# Altium schematic sheet MINIOLED.SchDoc
size A3
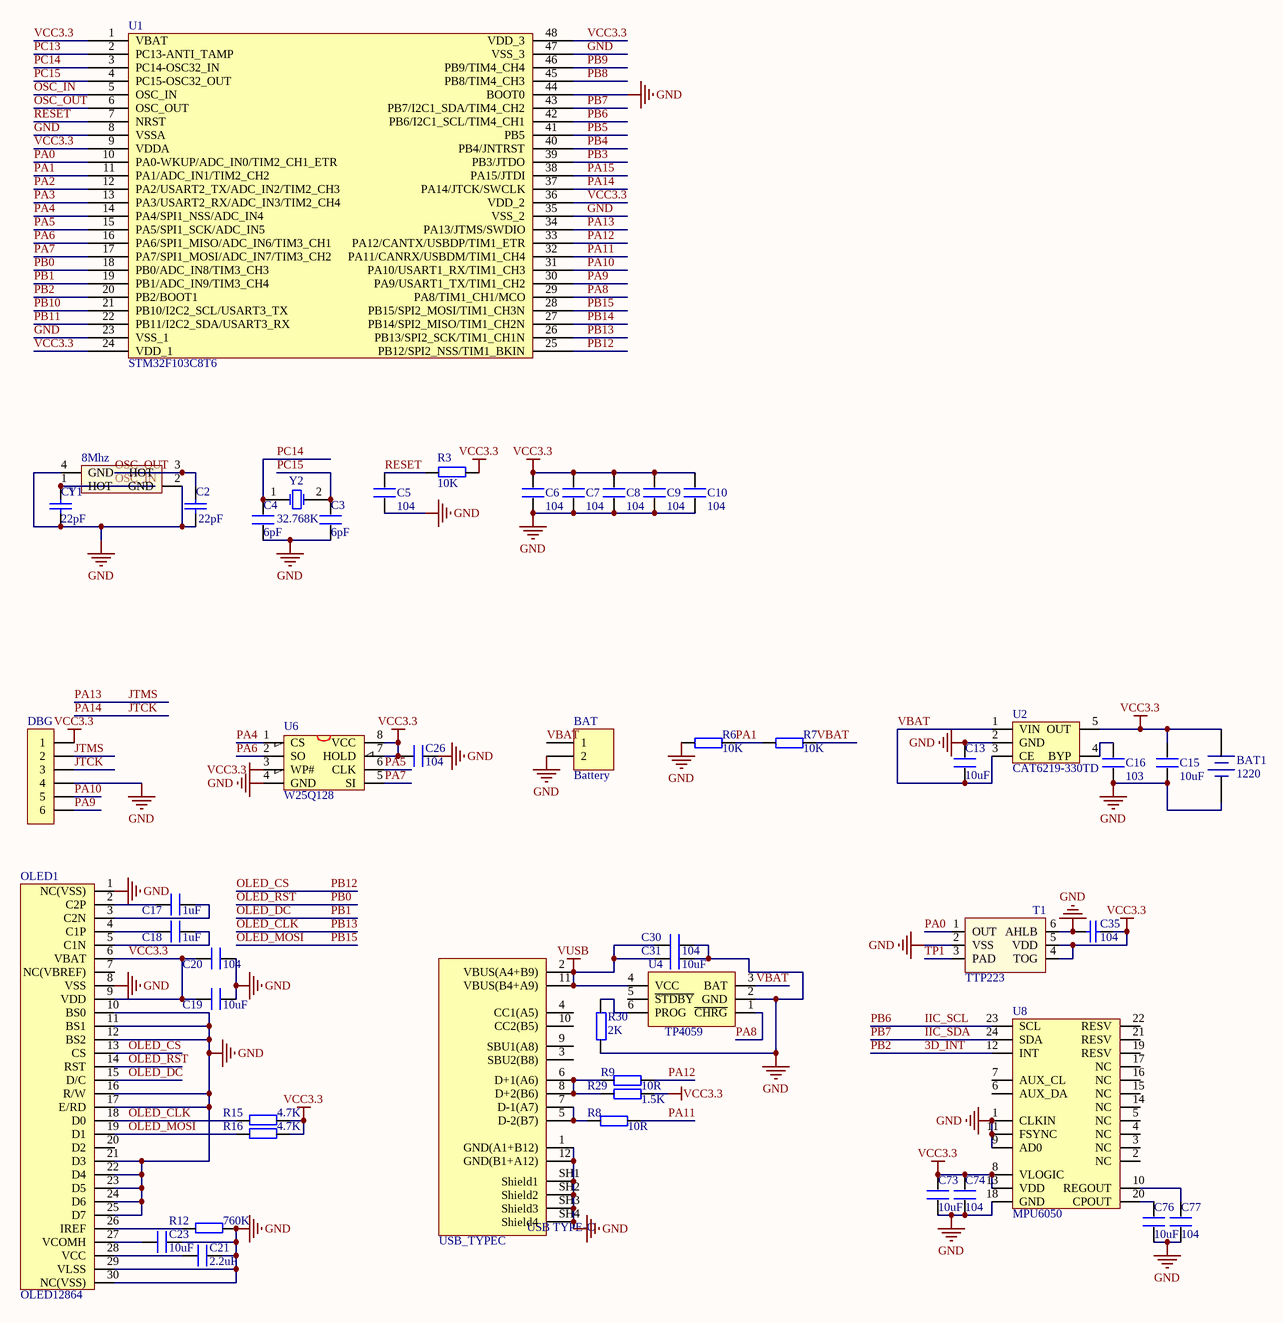
[diagram p0: MINIOLED.SchDoc]

## Parts
BAT  Battery  [HDR1X2]
BAT1  1220  [CR1220_B]
C1  22pF  [C 0402_L]
C2  22pF  [C 0402_L]
C3  6pF  [C 0402_L]
C4  6pF  [C 0402_L]
C5  104  [C 0402_L]
C6  104  [C 0402_L]
C7  104  [C 0402_L]
C8  104  [C 0402_L]
C9  104  [C 0402_L]
C10  104  [C 0402_L]
C13  10uF  [C 0402_L]
C15  10uF  [C 0402_L]
C16  103  [C 0402_L]
C17  1uF  [C 0402_L]
C18  1uF  [C 0402_L]
C19  10uF  [C 0402_L]
C20  104  [C 0402_L]
C21  2.2uF  [C 0402_L]
C23  10uF  [C 0402_L]
C26  104  [C 0603_L]
C30  104  [C 0402_L]
C31  10uF  [C 0402_L]
C35  104  [C 0402_L]
C73  10uF  [C 0402_L]
C74  104  [C 0402_L]
C76  10uF  [C 0402_L]
C77  104  [C 0402_L]
DBG  GPS&COMPASS  [SH1.0 S-W-6P]  (value not drawn)
OLED1  OLED12864  [OLED1.3]
R3  10K  [R 0402_L]
R6  10K  [R 0402_L]
R7  10K  [R 0402_L]
R8  10R  [R 0402_L]
R9  10R  [R 0402_L]
R12  760K  [R 0402_L]
R15  4.7K  [R 0402_L]
R16  4.7K  [R 0402_L]
R29  1.5K  [R 0402_L]
R30  2K  [R 0402_L]
T1  TTP223  [SOT23-6L]
U1  STM32F103C8T6  [LQFP48 7X7_L]
U2  CAT6219-330TD  [SOT-23-5]
U4  TP4059  [SOT23-6L]
U6  W25Q128  [SOP8W_L]
U8  MPU6050  [QFN24 4x4_N]
USB_TYPEC  USB TypeC  [USB Type-C]  (value not drawn)
Y1  8Mhz  [XTAL-3225]
Y2  32.768K  [OSC 3215-2P]

## Nets
GND: BAT.2 BAT1.2(DC-) C1.1 C2.1 C3.1 C4.1 C5.1 C6.1 C7.1 C8.1 C9.1 C10.1 C13.2 C15.1 C16.1 C19.1 C20.1 C21.1 C23.1 C26.2 C30.1 C31.1 C35.2 C73.2 C74.1 C76.1 C77.2 DBG.4 OLED1.1(NC(VSS)) OLED1.8(VSS) OLED1.10(BS0) OLED1.11(BS1) OLED1.12(BS2) OLED1.16(R/W) OLED1.17(E/RD) OLED1.21(D3) OLED1.22(D4) OLED1.23(D5) OLED1.24(D6) OLED1.25(D7) OLED1.29(VLSS) OLED1.30(NC(VSS)) R6.1 R12.1 R30.1 T1.2(VSS) T1.6(AHLB) U1.8(VSSA) U1.23(VSS_1) U1.35(VSS_2) U1.44(BOOT0) U1.47(VSS_3) U2.2(GND) U4.2(GND) U6.4(GND) U8.1(CLKIN) U8.9(AD0) U8.11(FSYNC) U8.18(GND) USB_TYPEC.1(GND(A1+B12)) USB_TYPEC.12(GND(B1+A12)) USB_TYPEC.SH1(Shield1) USB_TYPEC.SH2(Shield2) USB_TYPEC.SH3(Shield3) USB_TYPEC.SH4(Shield4) Y1.2(GND) Y1.4(GND)
VCC3.3: BAT1.1(DC+) C6.2 C7.2 C8.2 C9.2 C10.2 C15.2 C19.2 C20.2 C26.1 C35.1 C73.1 C74.2 DBG.1 OLED1.6(VBAT) OLED1.9(VDD) R3.1 R15.1 R16.1 R29.2 T1.4(TOG) T1.5(VDD) U1.1(VBAT) U1.9(VDDA) U1.24(VDD_1) U1.36(VDD_2) U1.48(VDD_3) U2.5(OUT) U6.3(WP#) U6.7(HOLD) U6.8(VCC) U8.8(VLOGIC) U8.13(VDD)
VUSB: C30.2 C31.2 U4.4(VCC) USB_TYPEC.2(VBUS(A4+B9)) USB_TYPEC.11(VBUS(B4+A9))
3D_INT: U1.20(PB2/BOOT1) U8.12(INT)  [also labelled PB2]
IIC_SCL: U1.42(PB6/I2C1_SCL/TIM4_CH1) U8.23(SCL)  [also labelled PB6]
IIC_SDA: U1.43(PB7/I2C1_SDA/TIM4_CH2) U8.24(SDA)  [also labelled PB7]
JTCK: DBG.3 U1.37(PA14/JTCK/SWCLK)  [also labelled PA14]
JTMS: DBG.2 U1.34(PA13/JTMS/SWDIO)  [also labelled PA13]
OLED_CLK: OLED1.18(D0) R15.2 U1.26(PB13/SPI2_SCK/TIM1_CH1N)  [also labelled PB13]
OLED_CS: OLED1.13(CS) U1.25(PB12/SPI2_NSS/TIM1_BKIN)  [also labelled PB12]
OLED_DC: OLED1.15(D/C) U1.19(PB1/ADC_IN9/TIM3_CH4)  [also labelled PB1]
OLED_MOSI: OLED1.19(D1) R16.2 U1.28(PB15/SPI2_MOSI/TIM1_CH3N)  [also labelled PB15]
OLED_RST: OLED1.14(RST) U1.18(PB0/ADC_IN8/TIM3_CH3)  [also labelled PB0]
OSC_IN: C1.2 U1.5(OSC_IN) Y1.1(HOT)
OSC_OUT: C2.2 U1.6(OSC_OUT) Y1.3(HOT)
PA0: T1.1(OUT) U1.10(PA0-WKUP/ADC_IN0/TIM2_CH1_ETR)
PA1: R6.2 R7.1 U1.11(PA1/ADC_IN1/TIM2_CH2)
PA2: U1.12(PA2/USART2_TX/ADC_IN2/TIM2_CH3)
PA3: U1.13(PA3/USART2_RX/ADC_IN3/TIM2_CH4)
PA4: U1.14(PA4/SPI1_NSS/ADC_IN4) U6.1(CS)
PA5: U1.15(PA5/SPI1_SCK/ADC_IN5) U6.6(CLK)
PA6: U1.16(PA6/SPI1_MISO/ADC_IN6/TIM3_CH1) U6.2(SO)
PA7: U1.17(PA7/SPI1_MOSI/ADC_IN7/TIM3_CH2) U6.5(SI)
PA8: U1.29(PA8/TIM1_CH1/MCO) U4.1(~{CHRG})
PA9: DBG.6 U1.30(PA9/USART1_TX/TIM1_CH2)
PA10: DBG.5 U1.31(PA10/USART1_RX/TIM1_CH3)
PA11: R8.2 U1.32(PA11/CANRX/USBDM/TIM1_CH4)
PA12: R9.2 U1.33(PA12/CANTX/USBDP/TIM1_ETR)
PA15: U1.38(PA15/JTDI)
PB3: U1.39(PB3/JTDO)
PB4: U1.40(PB4/JNTRST)
PB5: U1.41(PB5)
PB8: U1.45(PB8/TIM4_CH3)
PB9: U1.46(PB9/TIM4_CH4)
PB10: U1.21(PB10/I2C2_SCL/USART3_TX)
PB11: U1.22(PB11/I2C2_SDA/USART3_RX)
PB14: U1.27(PB14/SPI2_MISO/TIM1_CH2N)
PC13: U1.2(PC13-ANTI_TAMP)
PC14: C4.2 U1.3(PC14-OSC32_IN) Y2.1(OSC1)
PC15: C3.2 U1.4(PC15-OSC32_OUT) Y2.2(OSC2)
RESET: C5.2 R3.2 U1.7(NRST)
TP1: T1.3(PAD)
VBAT: BAT.1 C13.1 R7.2 U2.1(VIN) U2.3(CE) U4.3(BAT)
NetC16_2: C16.2 U2.4(BYP)
NetC17_1: C17.1 OLED1.3(C2N)
NetC17_2: C17.2 OLED1.2(C2P)
NetC18_1: C18.1 OLED1.5(C1N)
NetC18_2: C18.2 OLED1.4(C1P)
NetC21_2: C21.2 OLED1.28(VCC)
NetC23_2: C23.2 OLED1.27(VCOMH)
NetC76_2: C76.2 U8.20(CPOUT)
NetC77_1: C77.1 U8.10(REGOUT)
NetOLED1_26: OLED1.26(IREF) R12.2
NetR8_1: R8.1 USB_TYPEC.5(D-2(B7)) USB_TYPEC.7(D-1(A7))
NetR9_1: R9.1 R29.1 USB_TYPEC.6(D+1(A6)) USB_TYPEC.8(D+2(B6))
NetR30_2: R30.2 U4.6(PROG)

Not connected (* = marked no-connect by the designer): OLED1 7(NC(VBREF)) 20(D2); U4 5(~{STDBY}); U8 2(NC) 3(NC) 4(NC) 5(NC) 6(AUX_DA) 7(AUX_CL) 14(NC) 15(NC) 16(NC) 17(NC) 19(RESV) 21(RESV) 22(RESV); USB_TYPEC 3(SBU2(B8)) 4(CC1(A5)) 9(SBU1(A8)) 10(CC2(B5))

## Notes on the sheet
- (in symbol USB Type-C) USB TYPE-C

## Library data of the parts
BAT = Header 2: Header, 2-Pin; LatestRevisionDate: 17-Jul-2002; LatestRevisionNote: Re-released for DXP Platform.; Publisher: Altium Limited
BAT1 = CR-3V: 微型电池; 版权归属: 源创客; BOM名称: 微型电池; 学习资源: www.ooocke.com
C1 C2 = CAP
C3-C10 C13 C15-C21 C23 C26 C30 C31 C73 C74 C76 C77 = C
C35 = C-0603-SMD
DBG = Header 6: 6P接插件; 版权归属: 源创客; BOM名称: 6P接插件; 学习资源: www.ooocke.com
R3 R6-R9 R12 R15 R16 R29 R30 = R
U1 = U-STM32F103C8T6
U2 = CAT6219-330TD: 3.3V 500mA LDO
U6 = W25X16: W25X16;SST25VF016;MX25L1605
U8 = MPU6050: 9轴运动处理传感器
USB_TYPEC = USB Type-C: 12P TypeC 母座
Y1 = XTAL_3225: 3225贴片无源晶振
Y2 = XTAL: Crystal Oscillator; Published: 8-Jun-2000; LatestRevisionDate: 17-Jul-2002; LatestRevisionNote: Re-released for DXP Platform.; Publisher: Altium Limited